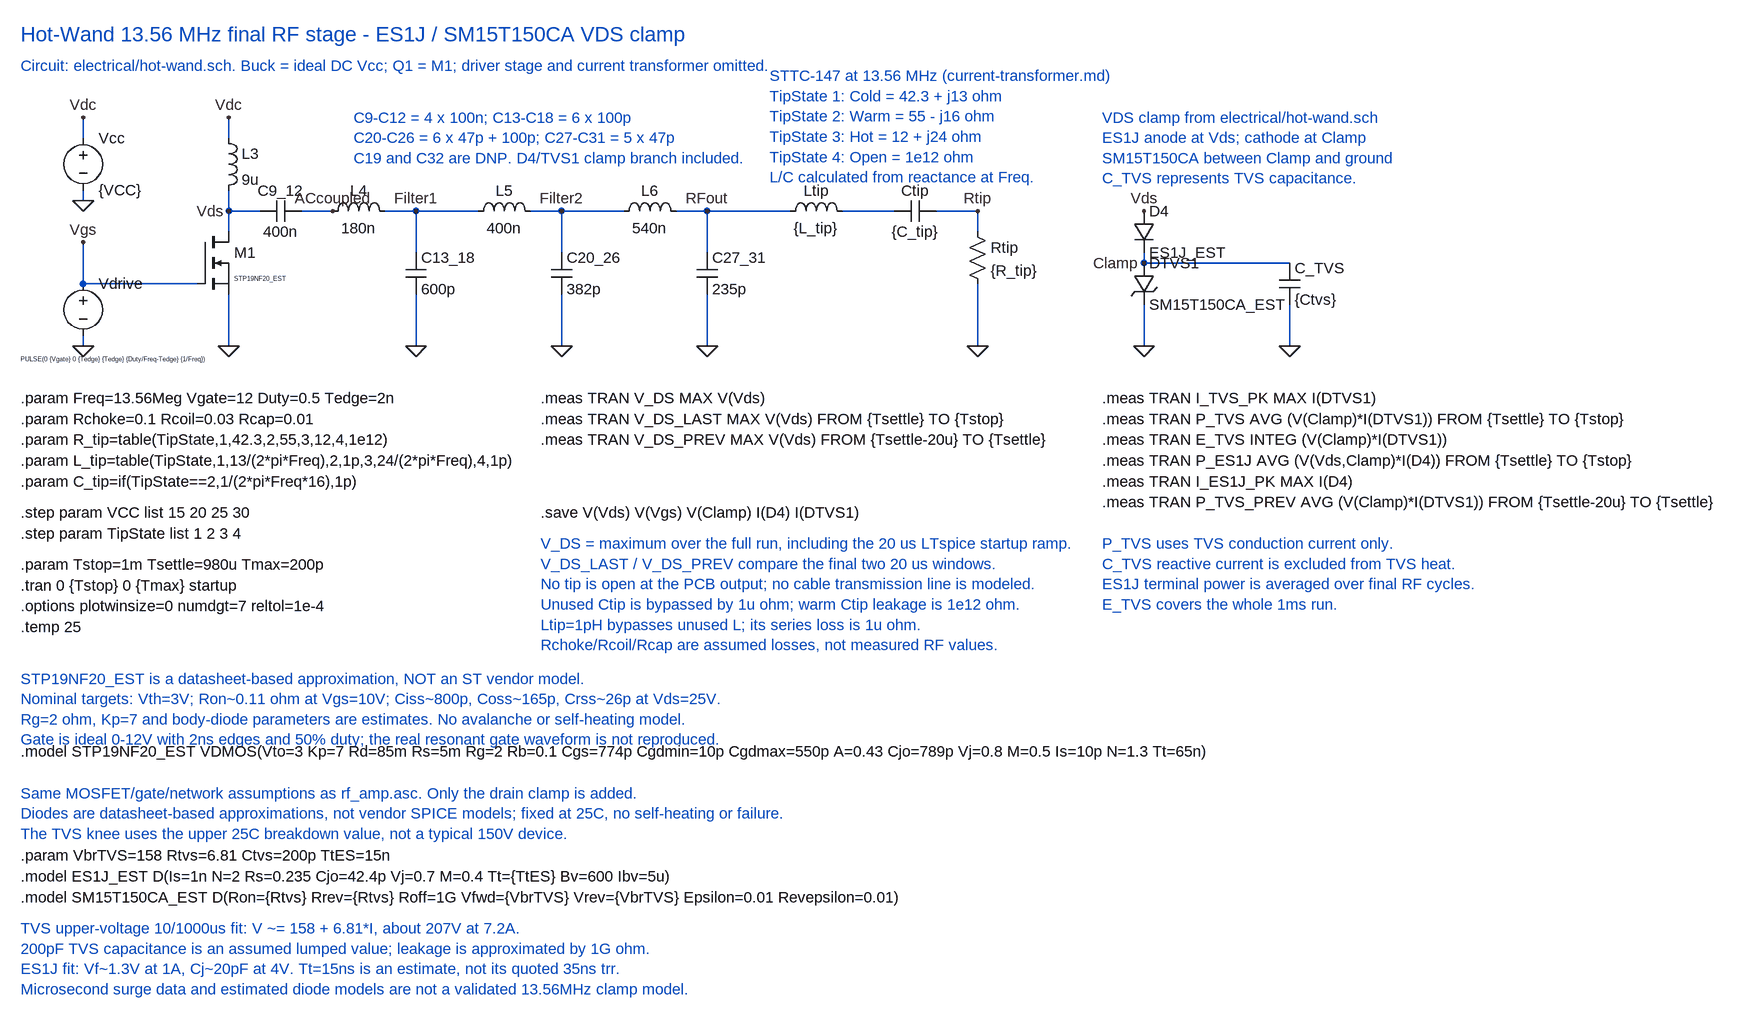
[diagram p0: schematic rf_amp_with_tvs_clamp.asc]
rf_amp_with_tvs_clamp.asc, the LTspice schematic file:
Version 4
SHEET 1 2688 1648
WIRE 128 96 128 64
WIRE 352 96 352 64
WIRE 352 208 352 176
WIRE 400 208 352 208
WIRE 512 208 464 208
WIRE 640 208 592 208
WIRE 736 208 640 208
WIRE 864 208 816 208
WIRE 960 208 864 208
WIRE 1088 208 1040 208
WIRE 1216 208 1088 208
WIRE 1376 208 1296 208
WIRE 1504 208 1440 208
WIRE 352 240 352 208
WIRE 640 272 640 208
WIRE 864 272 864 208
WIRE 1088 272 1088 208
WIRE 128 320 128 256
WIRE 304 320 128 320
WIRE 128 176 128 192
WIRE 128 416 128 400
WIRE 352 416 352 336
WIRE 640 416 640 336
WIRE 864 416 864 336
WIRE 1088 416 1088 336
WIRE 1504 240 1504 208
WIRE 1504 416 1504 320
WIRE 1760 288 1760 272
WIRE 1984 288 1760 288
WIRE 1760 416 1760 352
WIRE 1984 416 1984 352
FLAG 1760 208 Vds
FLAG 1760 288 Clamp
FLAG 1760 416 0
FLAG 1984 416 0
FLAG 128 64 Vdc
FLAG 352 64 Vdc
FLAG 128 192 0
FLAG 128 416 0
FLAG 352 416 0
FLAG 640 416 0
FLAG 864 416 0
FLAG 1088 416 0
FLAG 1504 416 0
FLAG 352 208 Vds
FLAG 128 256 Vgs
FLAG 512 208 ACcoupled
FLAG 640 208 Filter1
FLAG 864 208 Filter2
FLAG 1088 208 RFout
FLAG 1504 208 Rtip
SYMBOL voltage 128 80 R0
SYMATTR InstName Vcc
SYMATTR Value {VCC}
SYMBOL voltage 128 304 R0
WINDOW 3 -96 132 Left 0
SYMATTR InstName Vdrive
SYMATTR Value PULSE(0 {Vgate} 0 {Tedge} {Tedge} {Duty/Freq-Tedge} {1/Freq})
SYMBOL ind 336 80 R0
SYMATTR InstName L3
SYMATTR Value 9u
SYMATTR SpiceLine Rser={Rchoke} Rpar=1G
SYMBOL nmos 304 240 R0
WINDOW 3 56 72 Left 0
SYMATTR InstName M1
SYMATTR Value STP19NF20_EST
SYMBOL cap 464 192 R90
WINDOW 0 0 32 VBottom 2
WINDOW 3 32 32 VTop 2
SYMATTR InstName C9_12
SYMATTR Value 400n
SYMATTR SpiceLine Rser={Rcap}
SYMBOL ind 496 224 R270
WINDOW 0 32 56 VTop 2
WINDOW 3 5 56 VBottom 2
SYMATTR InstName L4
SYMATTR Value 180n
SYMATTR SpiceLine Rser={Rcoil} Rpar=1G
SYMBOL cap 624 272 R0
SYMATTR InstName C13_18
SYMATTR Value 600p
SYMATTR SpiceLine Rser={Rcap}
SYMBOL ind 720 224 R270
WINDOW 0 32 56 VTop 2
WINDOW 3 5 56 VBottom 2
SYMATTR InstName L5
SYMATTR Value 400n
SYMATTR SpiceLine Rser={Rcoil} Rpar=1G
SYMBOL cap 848 272 R0
SYMATTR InstName C20_26
SYMATTR Value 382p
SYMATTR SpiceLine Rser={Rcap}
SYMBOL ind 944 224 R270
WINDOW 0 32 56 VTop 2
WINDOW 3 5 56 VBottom 2
SYMATTR InstName L6
SYMATTR Value 540n
SYMATTR SpiceLine Rser={Rcoil} Rpar=1G
SYMBOL cap 1072 272 R0
SYMATTR InstName C27_31
SYMATTR Value 235p
SYMATTR SpiceLine Rser={Rcap}
SYMBOL ind 1200 224 R270
WINDOW 0 32 56 VTop 2
WINDOW 3 5 56 VBottom 2
SYMATTR InstName Ltip
SYMATTR Value {L_tip}
SYMATTR SpiceLine Rser=1u
SYMBOL cap 1440 192 R90
WINDOW 0 0 32 VBottom 2
WINDOW 3 32 32 VTop 2
SYMATTR InstName Ctip
SYMATTR Value {C_tip}
SYMATTR SpiceLine Rser=0 Rpar={if(TipState==2,1e12,1u)}
SYMBOL res 1488 224 R0
SYMATTR InstName Rtip
SYMATTR Value {R_tip}
SYMBOL diode 1744 208 R0
SYMATTR InstName D4
SYMATTR Value ES1J_EST
SYMBOL TVSdiode 1744 288 R0
SYMATTR InstName DTVS1
SYMATTR Value SM15T150CA_EST
SYMBOL cap 1968 288 R0
SYMATTR InstName C_TVS
SYMATTR Value {Ctvs}
TEXT 1696 64 Left 2 ;VDS clamp from electrical/hot-wand.sch\nES1J anode at Vds; cathode at Clamp\nSM15T150CA between Clamp and ground\nC_TVS represents TVS capacitance.
TEXT 32 -64 Left 3 ;Hot-Wand 13.56 MHz final RF stage - ES1J / SM15T150CA VDS clamp
TEXT 32 -16 Left 2 ;Circuit: electrical/hot-wand.sch. Buck = ideal DC Vcc; Q1 = M1; driver stage and current transformer omitted.
TEXT 544 64 Left 2 ;C9-C12 = 4 x 100n; C13-C18 = 6 x 100p\nC20-C26 = 6 x 47p + 100p; C27-C31 = 5 x 47p\nC19 and C32 are DNP. D4/TVS1 clamp branch included.
TEXT 1184 0 Left 2 ;STTC-147 at 13.56 MHz (current-transformer.md)\nTipState 1: Cold = 42.3 + j13 ohm\nTipState 2: Warm = 55 - j16 ohm\nTipState 3: Hot = 12 + j24 ohm\nTipState 4: Open = 1e12 ohm\nL/C calculated from reactance at Freq.
TEXT 32 496 Left 2 !.param Freq=13.56Meg Vgate=12 Duty=0.5 Tedge=2n
TEXT 32 528 Left 2 !.param Rchoke=0.1 Rcoil=0.03 Rcap=0.01
TEXT 32 560 Left 2 !.param R_tip=table(TipState,1,42.3,2,55,3,12,4,1e12)
TEXT 32 592 Left 2 !.param L_tip=table(TipState,1,13/(2*pi*Freq),2,1p,3,24/(2*pi*Freq),4,1p)
TEXT 32 624 Left 2 !.param C_tip=if(TipState==2,1/(2*pi*Freq*16),1p)
TEXT 32 672 Left 2 !.step param VCC list 15 20 25 30
TEXT 32 704 Left 2 !.step param TipState list 1 2 3 4
TEXT 32 752 Left 2 !.param Tstop=1m Tsettle=980u Tmax=200p
TEXT 32 784 Left 2 !.tran 0 {Tstop} 0 {Tmax} startup
TEXT 32 816 Left 2 !.options plotwinsize=0 numdgt=7 reltol=1e-4
TEXT 32 848 Left 2 !.temp 25
TEXT 832 496 Left 2 !.meas TRAN V_DS MAX V(Vds)
TEXT 832 528 Left 2 !.meas TRAN V_DS_LAST MAX V(Vds) FROM {Tsettle} TO {Tstop}
TEXT 832 560 Left 2 !.meas TRAN V_DS_PREV MAX V(Vds) FROM {Tsettle-20u} TO {Tsettle}
TEXT 832 672 Left 2 !.save V(Vds) V(Vgs) V(Clamp) I(D4) I(DTVS1)
TEXT 832 720 Left 2 ;V_DS = maximum over the full run, including the 20 us LTspice startup ramp.\nV_DS_LAST / V_DS_PREV compare the final two 20 us windows.\nNo tip is open at the PCB output; no cable transmission line is modeled.\nUnused Ctip is bypassed by 1u ohm; warm Ctip leakage is 1e12 ohm.\nLtip=1pH bypasses unused L; its series loss is 1u ohm.\nRchoke/Rcoil/Rcap are assumed losses, not measured RF values.
TEXT 32 928 Left 2 ;STP19NF20_EST is a datasheet-based approximation, NOT an ST vendor model.\nNominal targets: Vth=3V; Ron~0.11 ohm at Vgs=10V; Ciss~800p, Coss~165p, Crss~26p at Vds=25V.\nRg=2 ohm, Kp=7 and body-diode parameters are estimates. No avalanche or self-heating model.\nGate is ideal 0-12V with 2ns edges and 50% duty; the real resonant gate waveform is not reproduced.
TEXT 32 1040 Left 2 !.model STP19NF20_EST VDMOS(Vto=3 Kp=7 Rd=85m Rs=5m Rg=2 Rb=0.1 Cgs=774p Cgdmin=10p Cgdmax=550p A=0.43 Cjo=789p Vj=0.8 M=0.5 Is=10p N=1.3 Tt=65n)
TEXT 32 1104 Left 2 ;Same MOSFET/gate/network assumptions as rf_amp.asc. Only the drain clamp is added.\nDiodes are datasheet-based approximations, not vendor SPICE models; fixed at 25C, no self-heating or failure.\nThe TVS knee uses the upper 25C breakdown value, not a typical 150V device.
TEXT 32 1200 Left 2 !.param VbrTVS=158 Rtvs=6.81 Ctvs=200p TtES=15n
TEXT 32 1232 Left 2 !.model ES1J_EST D(Is=1n N=2 Rs=0.235 Cjo=42.4p Vj=0.7 M=0.4 Tt={TtES} Bv=600 Ibv=5u)
TEXT 32 1264 Left 2 !.model SM15T150CA_EST D(Ron={Rtvs} Rrev={Rtvs} Roff=1G Vfwd={VbrTVS} Vrev={VbrTVS} Epsilon=0.01 Revepsilon=0.01)
TEXT 32 1312 Left 2 ;TVS upper-voltage 10/1000us fit: V ~= 158 + 6.81*I, about 207V at 7.2A.\n200pF TVS capacitance is an assumed lumped value; leakage is approximated by 1G ohm.\nES1J fit: Vf~1.3V at 1A, Cj~20pF at 4V. Tt=15ns is an estimate, not its quoted 35ns trr.\nMicrosecond surge data and estimated diode models are not a validated 13.56MHz clamp model.
TEXT 1696 496 Left 2 !.meas TRAN I_TVS_PK MAX I(DTVS1)
TEXT 1696 528 Left 2 !.meas TRAN P_TVS AVG (V(Clamp)*I(DTVS1)) FROM {Tsettle} TO {Tstop}
TEXT 1696 560 Left 2 !.meas TRAN E_TVS INTEG (V(Clamp)*I(DTVS1))
TEXT 1696 592 Left 2 !.meas TRAN P_ES1J AVG (V(Vds,Clamp)*I(D4)) FROM {Tsettle} TO {Tstop}
TEXT 1696 624 Left 2 !.meas TRAN I_ES1J_PK MAX I(D4)
TEXT 1696 656 Left 2 !.meas TRAN P_TVS_PREV AVG (V(Clamp)*I(DTVS1)) FROM {Tsettle-20u} TO {Tsettle}
TEXT 1696 720 Left 2 ;P_TVS uses TVS conduction current only.\nC_TVS reactive current is excluded from TVS heat.\nES1J terminal power is averaged over final RF cycles.\nE_TVS covers the whole 1ms run.

The netlist it stands for:
* rf_amp_with_tvs_clamp.asc
Vcc Vdc 0 {VCC}
Vdrive Vgs 0 PULSE(0 {Vgate} 0 {Tedge} {Tedge} {Duty/Freq-Tedge} {1/Freq})
L3 Vdc Vds 9u Rser={Rchoke} Rpar=1G
M1 Vds Vgs 0 0 STP19NF20_EST
C9_12 ACcoupled Vds 400n Rser={Rcap}
L4 ACcoupled Filter1 180n Rser={Rcoil} Rpar=1G
C13_18 Filter1 0 600p Rser={Rcap}
L5 Filter1 Filter2 400n Rser={Rcoil} Rpar=1G
C20_26 Filter2 0 382p Rser={Rcap}
L6 Filter2 RFout 540n Rser={Rcoil} Rpar=1G
C27_31 RFout 0 235p Rser={Rcap}
Ltip RFout N001 {L_tip} Rser=1u
Ctip Rtip N001 {C_tip} Rser=0 Rpar={if(TipState==2,1e12,1u)}
Rtip Rtip 0 {R_tip}
D4 Vds Clamp ES1J_EST
DTVS1 Clamp 0 SM15T150CA_EST
C_TVS Clamp 0 {Ctvs}
.model D D
.lib standard.dio
.model NMOS NMOS
.model PMOS PMOS
.lib standard.mos
* VDS clamp from electrical/hot-wand.sch
* ES1J anode at Vds; cathode at Clamp
* SM15T150CA between Clamp and ground
* C_TVS represents TVS capacitance.
* Hot-Wand 13.56 MHz final RF stage - ES1J / SM15T150CA VDS clamp
* Circuit: electrical/hot-wand.sch. Buck = ideal DC Vcc; Q1 = M1; driver stage and current transformer omitted.
* C9-C12 = 4 x 100n; C13-C18 = 6 x 100p
* C20-C26 = 6 x 47p + 100p; C27-C31 = 5 x 47p
* C19 and C32 are DNP. D4/TVS1 clamp branch included.
* STTC-147 at 13.56 MHz (current-transformer.md)
* TipState 1: Cold = 42.3 + j13 ohm
* TipState 2: Warm = 55 - j16 ohm
* TipState 3: Hot = 12 + j24 ohm
* TipState 4: Open = 1e12 ohm
* L/C calculated from reactance at Freq.
.param Freq=13.56Meg Vgate=12 Duty=0.5 Tedge=2n
.param Rchoke=0.1 Rcoil=0.03 Rcap=0.01
.param R_tip=table(TipState,1,42.3,2,55,3,12,4,1e12)
.param L_tip=table(TipState,1,13/(2*pi*Freq),2,1p,3,24/(2*pi*Freq),4,1p)
.param C_tip=if(TipState==2,1/(2*pi*Freq*16),1p)
.step param VCC list 15 20 25 30
.step param TipState list 1 2 3 4
.param Tstop=1m Tsettle=980u Tmax=200p
.tran 0 {Tstop} 0 {Tmax} startup
.options plotwinsize=0 numdgt=7 reltol=1e-4
.temp 25
.meas TRAN V_DS MAX V(Vds)
.meas TRAN V_DS_LAST MAX V(Vds) FROM {Tsettle} TO {Tstop}
.meas TRAN V_DS_PREV MAX V(Vds) FROM {Tsettle-20u} TO {Tsettle}
.save V(Vds) V(Vgs) V(Clamp) I(D4) I(DTVS1)
* V_DS = maximum over the full run, including the 20 us LTspice startup ramp.
* V_DS_LAST / V_DS_PREV compare the final two 20 us windows.
* No tip is open at the PCB output; no cable transmission line is modeled.
* Unused Ctip is bypassed by 1u ohm; warm Ctip leakage is 1e12 ohm.
* Ltip=1pH bypasses unused L; its series loss is 1u ohm.
* Rchoke/Rcoil/Rcap are assumed losses, not measured RF values.
* STP19NF20_EST is a datasheet-based approximation, NOT an ST vendor model.
* Nominal targets: Vth=3V; Ron~0.11 ohm at Vgs=10V; Ciss~800p, Coss~165p, Crss~26p at Vds=25V.
* Rg=2 ohm, Kp=7 and body-diode parameters are estimates. No avalanche or self-heating model.
* Gate is ideal 0-12V with 2ns edges and 50% duty; the real resonant gate waveform is not reproduced.
.model STP19NF20_EST VDMOS(Vto=3 Kp=7 Rd=85m Rs=5m Rg=2 Rb=0.1 Cgs=774p Cgdmin=10p Cgdmax=550p A=0.43 Cjo=789p Vj=0.8 M=0.5 Is=10p N=1.3 Tt=65n)
* Same MOSFET/gate/network assumptions as rf_amp.asc. Only the drain clamp is added.
* Diodes are datasheet-based approximations, not vendor SPICE models; fixed at 25C, no self-heating or failure.
* The TVS knee uses the upper 25C breakdown value, not a typical 150V device.
.param VbrTVS=158 Rtvs=6.81 Ctvs=200p TtES=15n
.model ES1J_EST D(Is=1n N=2 Rs=0.235 Cjo=42.4p Vj=0.7 M=0.4 Tt={TtES} Bv=600 Ibv=5u)
.model SM15T150CA_EST D(Ron={Rtvs} Rrev={Rtvs} Roff=1G Vfwd={VbrTVS} Vrev={VbrTVS} Epsilon=0.01 Revepsilon=0.01)
* TVS upper-voltage 10/1000us fit: V ~= 158 + 6.81*I, about 207V at 7.2A.
* 200pF TVS capacitance is an assumed lumped value; leakage is approximated by 1G ohm.
* ES1J fit: Vf~1.3V at 1A, Cj~20pF at 4V. Tt=15ns is an estimate, not its quoted 35ns trr.
* Microsecond surge data and estimated diode models are not a validated 13.56MHz clamp model.
.meas TRAN I_TVS_PK MAX I(DTVS1)
.meas TRAN P_TVS AVG (V(Clamp)*I(DTVS1)) FROM {Tsettle} TO {Tstop}
.meas TRAN E_TVS INTEG (V(Clamp)*I(DTVS1))
.meas TRAN P_ES1J AVG (V(Vds,Clamp)*I(D4)) FROM {Tsettle} TO {Tstop}
.meas TRAN I_ES1J_PK MAX I(D4)
.meas TRAN P_TVS_PREV AVG (V(Clamp)*I(DTVS1)) FROM {Tsettle-20u} TO {Tsettle}
* P_TVS uses TVS conduction current only.
* C_TVS reactive current is excluded from TVS heat.
* ES1J terminal power is averaged over final RF cycles.
* E_TVS covers the whole 1ms run.
.backanno
.end